# EAGLE design Sensor Decoderv0.6 (EAGLE 8.4.3)
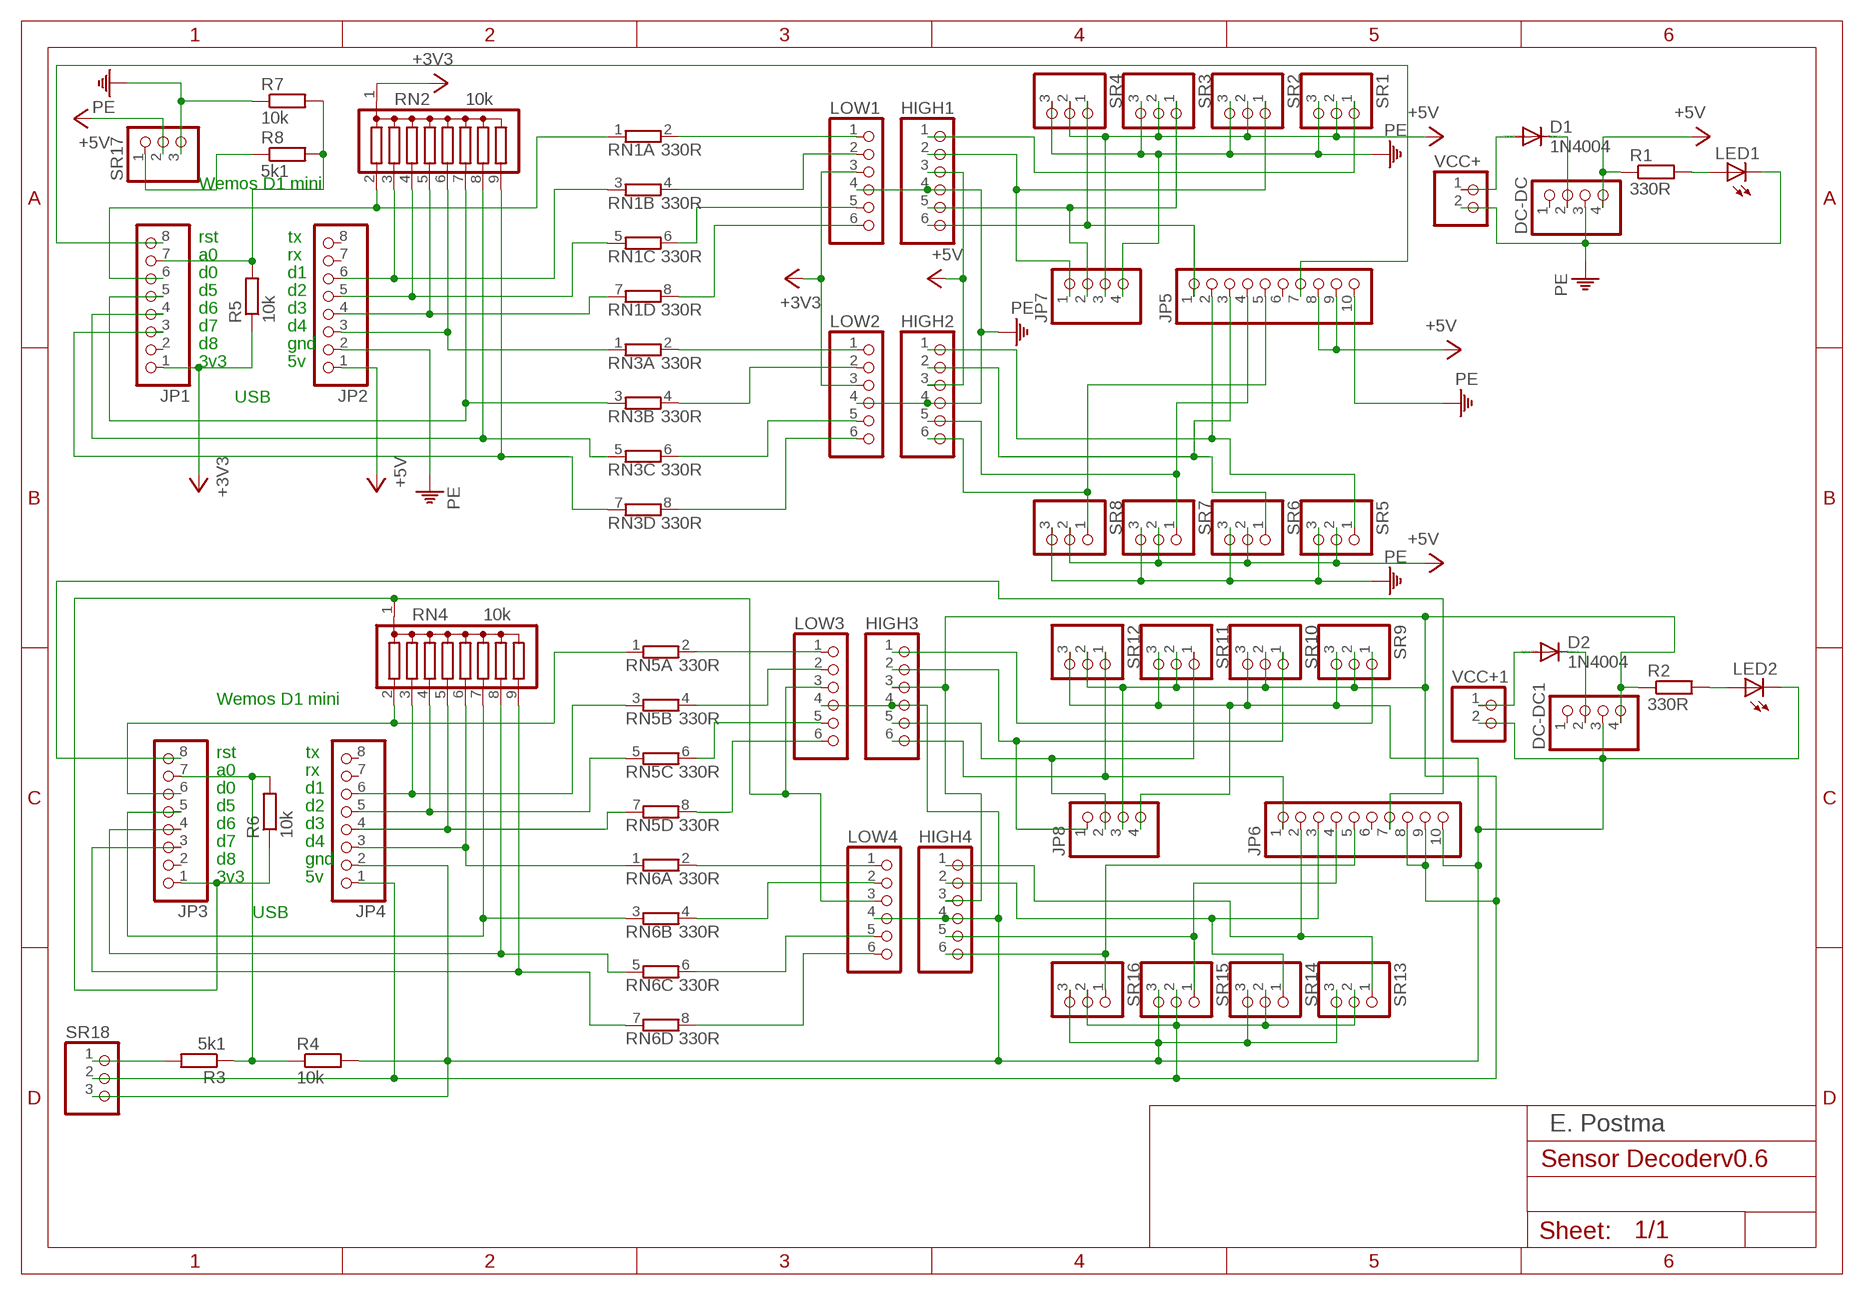
[diagram p0: schematic, sheet 1]

## Parts
D1  1N4004  [DO41-10]
D2  1N4004  [DO41-10]
DC-DC  PINHD-1X4  [1X04]
DC-DC1  PINHD-1X4  [1X04]
HIGH1  PINHD-1X6  [1X06]
HIGH2  PINHD-1X6  [1X06]
HIGH3  PINHD-1X6  [1X06]
HIGH4  PINHD-1X6  [1X06]
JP1  PINHD-1X8  [1X08]
JP2  PINHD-1X8  [1X08]
JP3  PINHD-1X8  [1X08]
JP4  PINHD-1X8  [1X08]
JP5  PINHD-1X10  [1X10]
JP6  PINHD-1X10  [1X10]
JP7  PINHD-1X4  [1X04]
JP8  PINHD-1X4  [1X04]
LED1  LED3MM  [LED3MM]
LED2  LED3MM  [LED3MM]
LOW1  PINHD-1X6  [1X06]
LOW2  PINHD-1X6  [1X06]
LOW3  PINHD-1X6  [1X06]
LOW4  PINHD-1X6  [1X06]
R1  330R  R-EU_0207/7  [0207/7]
R2  330R  R-EU_0207/7  [0207/7]
R3  5k1  R-EU_0207/7  [0207/7]
R4  10k  R-EU_0207/7  [0207/7]
R5  10k  R-EU_0207/7  [0207/7]
R6  10k  R-EU_0207/7  [0207/7]
R7  10k  R-EU_0207/7  [0207/7]
R8  5k1  R-EU_0207/7  [0207/7]
RN1  330R  E4R  [SIL8]
RN2  10k  G08R  [SIL9]
RN3  330R  E4R  [SIL8]
RN4  10k  G08R  [SIL9]
RN5  330R  E4R  [SIL8]
RN6  330R  E4R  [SIL8]
SR1  PINHD-1X3  [1X03]
SR2  PINHD-1X3  [1X03]
SR3  PINHD-1X3  [1X03]
SR4  PINHD-1X3  [1X03]
SR5  PINHD-1X3  [1X03]
SR6  PINHD-1X3  [1X03]
SR7  PINHD-1X3  [1X03]
SR8  PINHD-1X3  [1X03]
SR9  PINHD-1X3  [1X03]
SR10  PINHD-1X3  [1X03]
SR11  PINHD-1X3  [1X03]
SR12  PINHD-1X3  [1X03]
SR13  PINHD-1X3  [1X03]
SR14  PINHD-1X3  [1X03]
SR15  PINHD-1X3  [1X03]
SR16  PINHD-1X3  [1X03]
SR17  PINHD-1X3  [1X03]
SR18  PINHD-1X3  [1X03]
VCC+  PINHD-1X2  [1X02]
VCC+1  PINHD-1X2  [1X02]

## Nets
+3V3 [3.3V]: JP1.1 LOW1.3 LOW2.3 R5.1 RN2.1
+5V [5V]: DC-DC.4 HIGH1.3 HIGH2.3 JP2.1 JP5.8 JP5.9 JP7.3 R1.1 SR1.2 SR2.2 SR3.2 SR4.2 SR5.2 SR6.2 SR7.2 SR8.2 SR17.2
N$1: HIGH2.6 JP5.5 SR8.1
N$2: JP1.6 RN1.1 RN2.2
N$3: JP1.4 RN2.8 RN3.5
N$4 [5V]: D1.C DC-DC.2
N$5: JP1.5 RN2.7 RN3.3
N$6: LED1.A R1.2
N$7: JP2.5 RN1.5 RN2.4
N$8: HIGH2.5 JP5.4 SR7.1
N$9: JP2.3 RN2.6 RN3.1
N$10: JP2.6 RN1.3 RN2.3
N$11: JP1.3 RN2.9 RN3.7
N$12: LOW1.1 RN1.2
N$13: JP2.4 RN1.7 RN2.5
N$14: HIGH1.5 JP7.2 SR3.1
N$15: HIGH1.1 SR1.1
N$16: HIGH1.6 JP5.1 SR4.1
N$17: HIGH1.2 JP7.1 SR2.1
N$18: HIGH2.2 JP5.3 SR6.1
N$19: HIGH2.1 JP5.2 SR5.1
N$20: JP3.6 RN4.2 RN5.1
N$21: LED2.A R2.2
N$22: JP4.6 RN4.3 RN5.3
N$23: JP4.5 RN4.4 RN5.5
N$24: JP4.4 RN4.5 RN5.7
N$25 [5V]: D2.A VCC+1.1
N$26 [5V]: D2.C DC-DC1.2
N$27: JP4.3 RN4.6 RN6.1
N$28: JP3.5 RN4.7 RN6.3
N$29: JP3.4 RN4.8 RN6.5
N$30: JP3.3 RN4.9 RN6.7
N$31: LOW3.1 RN5.2
N$32: LOW3.2 RN5.4
N$33: LOW3.5 RN5.6
N$34: LOW3.6 RN5.8
N$35: LOW4.1 RN6.2
N$36: LOW4.2 RN6.4
N$37: LOW4.5 RN6.6
N$38: LOW4.6 RN6.8
N$39: HIGH4.6 JP6.5 SR16.1
N$40: HIGH4.5 JP6.4 SR15.1
N$41 [Gnd]: DC-DC1.3 HIGH3.4 HIGH4.4 JP4.2 JP6.10 JP8.4 LED2.K(C) LOW3.4 LOW4.4 R4.2 SR9.3 SR10.3 SR11.3 SR12.3 SR13.3 SR14.3 SR15.3 SR16.3 SR18.3 VCC+1.2
N$42 [Gnd]: JP3.8 JP6.7
N$43: JP1.8 JP5.7
N$44: LOW1.2 RN1.4
N$45: LOW1.5 RN1.6
N$46: LOW1.6 RN1.8
N$47 [5V]: D1.A VCC+.1
N$48: LOW2.1 RN3.2
N$49: LOW2.2 RN3.4
N$50: LOW2.5 RN3.6
N$51: LOW2.6 RN3.8
N$52 [5V]: DC-DC1.4 HIGH3.3 HIGH4.3 JP4.1 JP6.8 JP6.9 JP8.3 R2.1 SR9.2 SR10.2 SR11.2 SR12.2 SR13.2 SR14.2 SR15.2 SR16.2 SR18.2
N$53: HIGH3.1 SR9.1
N$54 [3.3V]: JP3.1 LOW3.3 LOW4.3 R6.1 RN4.1
N$58: JP1.7 R5.2 R7.2 R8.2
N$59: JP3.7 R3.1 R4.1 R6.2
N$60: R3.2 SR18.1
N$61: HIGH3.2 JP8.1 SR10.1
N$62: R8.1 SR17.1
N$63: HIGH3.5 JP8.2 SR11.1
N$64: HIGH3.6 JP6.1 SR12.1
N$65: HIGH4.2 JP6.3 SR14.1
N$66: HIGH4.1 JP6.2 SR13.1
PE [Gnd]: DC-DC.3 HIGH1.4 HIGH2.4 JP2.2 JP5.10 JP7.4 LED1.K(C) LOW1.4 LOW2.4 R7.1 SR1.3 SR2.3 SR3.3 SR4.3 SR5.3 SR6.3 SR7.3 SR8.3 SR17.3 VCC+.2
Unconnected: DC-DC1.1 DC-DC.1 JP1.2 JP2.7 JP2.8 JP3.2 JP4.7 JP4.8 JP5.6 JP6.6

## Notes on the sheet
- Wemos D1 mini
- rst | tx
- a0 | rx
- d0 | d1
- d5 | d2
- d6 | d3
- d7 | d4
- d8 | gnd
- 3v3 | 5v
- USB
- Wemos D1 mini
- rst | tx
- a0 | rx
- d0 | d1
- d5 | d2
- d6 | d3
- d7 | d4
- d8 | gnd
- 3v3 | 5v
- USB
- E. Postma

## Library data of the parts
D1 D2 = diode:1N4004: DIODE general purpose rectifier, 1 A
DC-DC DC-DC1 JP7 JP8 = pinhead:PINHD-1X4: PIN HEADER
HIGH1-HIGH4 LOW1-LOW4 = pinhead:PINHD-1X6: PIN HEADER
JP1-JP4 = pinhead:PINHD-1X8: PIN HEADER
JP5 JP6 = pinhead:PINHD-1X10: PIN HEADER
LED1 LED2 = led:LED: LED OSRAM: - CHIPLED LG R971, LG N971, LY N971, LG Q971, LY Q971, LO R971, LY R971 LH N974, LH R974 LS Q976, LO Q976, LY Q976 LO Q996 - Hyper CHIPLED LW Q18S LB Q993, LB Q99A, LB R99A - SideLED LS A670, LO A670, LY A670, LG A670, LP A670 LB A673, LV A673, LT A673, LW A673 LH A674 LY A675 LS A676, LA A676, LO A676, LY A676, LW A676 LS A679, LY A679, LG A679 - Hyper Micro SIDELED® LS Y876, LA Y876, LO Y876, LY Y876 LT Y87S - SmartLED LW L88C, LW L88S LB L89C, LB L89S, LG L890 LS L89K, LO L89K, LY L89K LS L896, LA L896, LO L896, LY L896 - TOPLED LS T670, LO T670, LY T670, LG T670, LP T670 LSG T670, LSP T670, LSY T670, LOP T670, LYG T670 LG T671, LOG T671, LSG T671 LB T673, LV T673, LT T673, LW T673 LH T674 LS T676, LA T676, LO T676, LY T676, LB T676, LH T676, LSB T676, LW T676 LB T67C, LV T67C, LT T67C, LS T67K, LO T67K, LY T67K, LW E67C LS E67B, LA E67B, LO E67B, LY E67B, LB E67C, LV E67C, LT E67C LW T67C LS T679, LY T679, LG T679 LS T770, LO T770, LY T770, LG T770, LP T770 LB T773, LV T773, LT T773, LW T773 LH T774 LS E675, LA E675, LY E675, LS T675 LS T776, LA T776, LO T776, LY T776, LB T776 LHGB T686 LT T68C, LB T68C - Hyper Mini TOPLED® LB M676 - Mini TOPLED Santana® LG M470 LS M47K, LO M47K, LY M47K Source: http://www.osram.convergy.de LUXEON: - LUMILED® LXK2-PW12-R00, LXK2-PW12-S00, LXK2-PW14-U00, LXK2-PW14-V00 LXK2-PM12-R00, LXK2-PM12-S00, LXK2-PM14-U00 LXK2-PE12-Q00, LXK2-PE12-R00, LXK2-PE12-S00, LXK2-PE14-T00, LXK2-PE14-U00 LXK2-PB12-K00, LXK2-PB12-L00, LXK2-PB12-M00, LXK2-PB14-N00, LXK2-PB14-P00, LXK2-PB14-Q00 LXK2-PR12-L00, LXK2-PR12-M00, LXK2-PR14-Q00, LXK2-PR14-R00 LXK2-PD12-Q00, LXK2-PD12-R00, LXK2-PD12-S00 LXK2-PH12-R00, LXK2-PH12-S00 LXK2-PL12-P00, LXK2-PL12-Q00, LXK2-PL12-R00 Source: www.luxeon.com KINGBRIGHT: KA-3528ASYC Source: www.kingbright.com
R1-R8 = resistor:R-EU_: RESISTOR, European symbol
RN1 RN3 RN5 RN6 = resistor-sil:E4R: SIL RESISTOR; OC_FARNELL: unknown; OC_NEWARK: unknown
RN2 RN4 = resistor-sil:G08R: SIL RESISTOR; OC_FARNELL: unknown; OC_NEWARK: unknown
SR1-SR18 = pinhead:PINHD-1X3: PIN HEADER
VCC+ VCC+1 = pinhead:PINHD-1X2: PIN HEADER

## Net classes
0 default: width 0.508 mm, clearance 0.254 mm
1 5V: width 0.762 mm, clearance 0.254 mm
2 Gnd: width 0.762 mm, clearance 0.254 mm
3 extra: width 0.762 mm, clearance 0.254 mm
4 3.3V: width 0.508 mm, clearance 0.254 mm

## Board
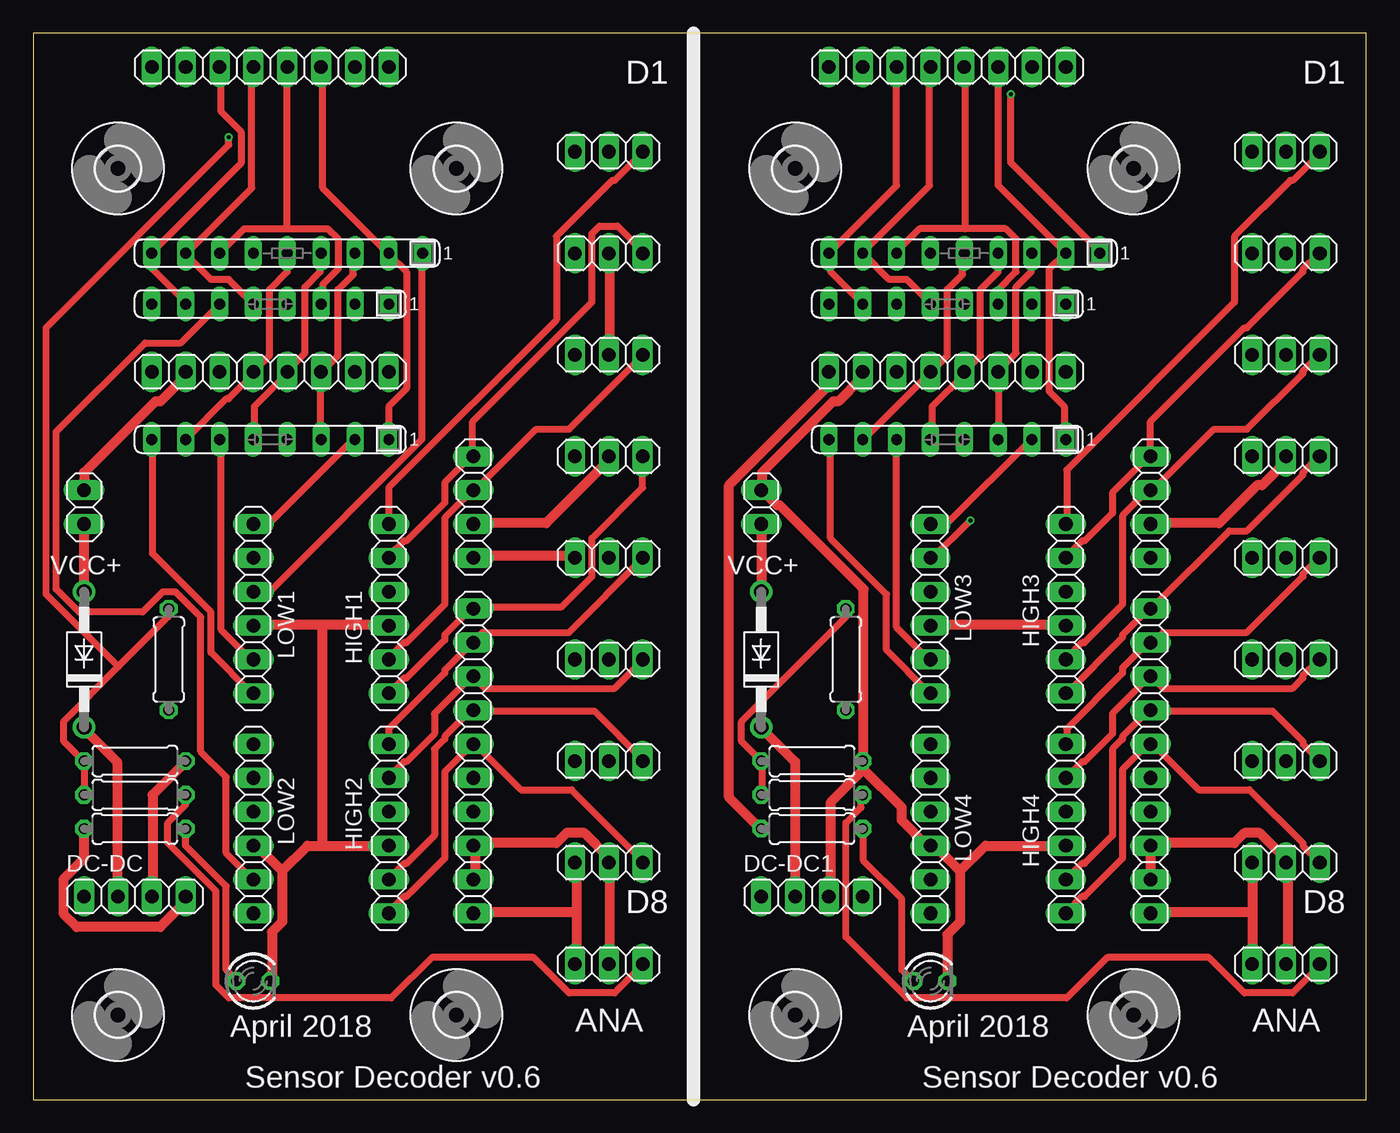
[diagram p1: board, top side]
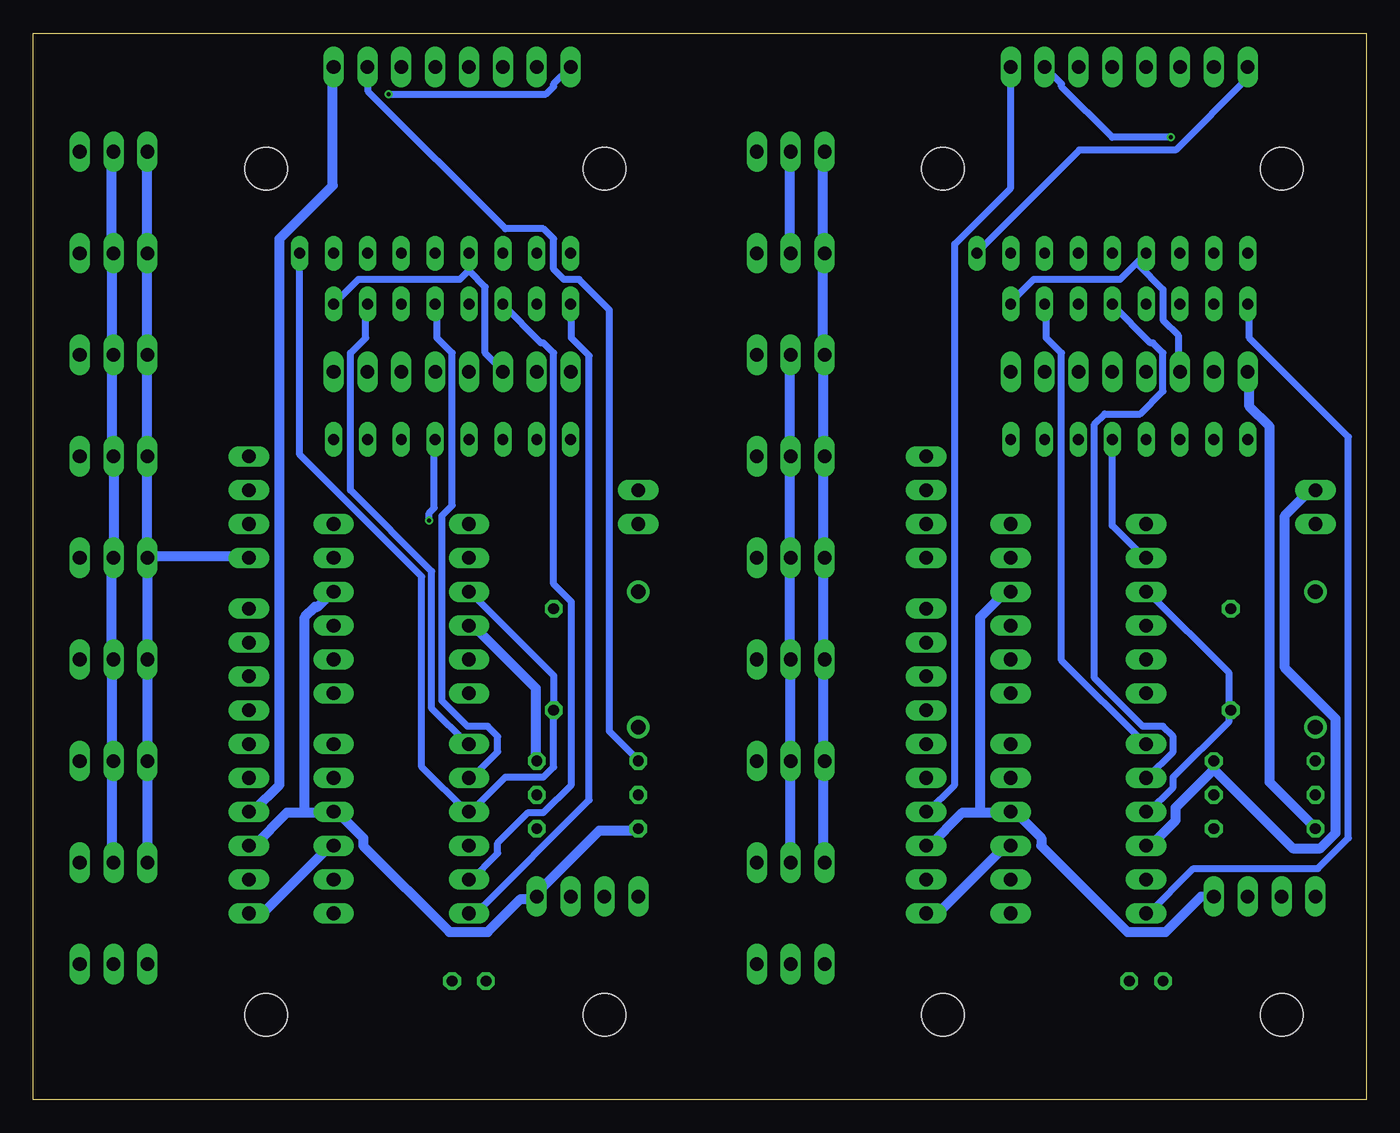
[diagram p2: board, bottom side, seen from below]

Size 100 x 80 mm. Coordinates in mm from the lower left corner, seen from the top.
Outline: 0,0 100,0 100,80 0,80 0,0
Copper layers (1*16): Top 0.035mm / dielectric 1.5mm / Bottom 0.035mm
Design rules "NOA Eagle Rule 2016-06-12": minimum track width 6mil, minimum drill 0.3mm, track to track 6mil, track to pad 6mil, pad to pad 6mil, via to via 6mil, smd to smd 0mil, copper to edge 0.4mm, drill to drill 10mil, minimum pad ring 10mil, minimum via ring 6mil, stop-mask expansion 2mil, vias tented up to drill 25mil, thermal gap 10mil
tKeepout: 1 lines
tRestrict: 1 lines
bRestrict: 1 lines

### Footprints (pad centres in the part's own frame; a part is rotated, then mirrored left to right if it is on the bottom)
DO41-10 = drill 1.118: A 5.08,0; C -5.08,0
1X04 = drill 1.016 long: 1 -3.81,0; 2 -1.27,0; 3 1.27,0; 4 3.81,0
1X06 = drill 1.016 long: 1 -6.35,0; 2 -3.81,0; 3 -1.27,0; 4 1.27,0; 5 3.81,0; 6 6.35,0
1X08 = drill 1.016 long: 1 -8.89,0; 2 -6.35,0; 3 -3.81,0; 4 -1.27,0; 5 1.27,0; 6 3.81,0; 7 6.35,0; 8 8.89,0
1X10 = drill 1.016 long: 1 -11.43,0; 2 -8.89,0; 3 -6.35,0; 4 -3.81,0; 5 -1.27,0; 6 1.27,0; 7 3.81,0; 8 6.35,0; 9 8.89,0; 10 11.43,0
LED3MM = drill 0.813 octagon: A -1.27,0; K 1.27,0
0207/7 = drill 0.813 octagon: 1 -3.81,0; 2 3.81,0
SIL8 = drill 0.813 long: 1 -8.89,0; 2 -6.35,0; 3 -3.81,0; 4 -1.27,0; 5 1.27,0; 6 3.81,0; 7 6.35,0; 8 8.89,0
SIL9 = drill 0.813 long: 1 -10.16,0; 2 -7.62,0; 3 -5.08,0; 4 -2.54,0; 5 0,0; 6 2.54,0; 7 5.08,0; 8 7.62,0; 9 10.16,0
1X03 = drill 1.016 long: 1 -2.54,0; 2 0,0; 3 2.54,0
3,2 = hole 3.2: 0,0
1X02 = drill 1.016 long: 1 -1.27,0; 2 1.27,0

### Placement (x,y rotation side)
D1  3.81,33.02 90 top
D2  54.61,33.02 90 top
DC-DC  7.62,15.24 0 top
DC-DC1  58.42,15.24 0 top
HIGH1  26.67,36.83 270 top
HIGH2  26.67,20.32 270 top
HIGH3  77.47,36.83 270 top
HIGH4  77.47,20.32 270 top
JP1  17.78,77.47 0 top
JP2  17.78,54.61 0 top
JP3  68.58,77.47 0 top
JP4  68.58,54.61 0 top
JP5  33.02,25.4 270 top
JP6  83.82,25.4 270 top
JP7  33.02,44.45 270 top
JP8  83.82,44.45 270 top
LED1  16.51,8.89 0 top
LED2  67.31,8.89 0 top
LOW1  16.51,36.83 270 top
LOW2  16.51,20.32 270 top
LOW3  67.31,36.83 270 top
LOW4  67.31,20.32 270 top
R1  7.62,20.32 0 top
R2  58.42,20.32 0 top
R3  58.42,22.86 0 top
R4  58.42,25.4 0 top
R5  10.16,33.02 90 top
R6  60.96,33.02 90 top
R7  7.62,25.4 180 top
R8  7.62,22.86 180 top
RN1  17.78,49.53 180 top
RN2  19.05,63.5 180 top
RN3  17.78,59.69 180 top
RN4  69.85,63.5 180 top
RN5  68.58,49.53 180 top
RN6  68.58,59.69 180 top
SR1  43.18,71.12 180 top
SR2  43.18,63.5 180 top
SR3  43.18,55.88 180 top
SR4  43.18,48.26 180 top
SR5  43.18,40.64 180 top
SR6  43.18,33.02 180 top
SR7  43.18,25.4 180 top
SR8  43.18,17.78 180 top
SR9  93.98,71.12 180 top
SR10  93.98,63.5 180 top
SR11  93.98,55.88 180 top
SR12  93.98,48.26 180 top
SR13  93.98,40.64 180 top
SR14  93.98,33.02 180 top
SR15  93.98,25.4 180 top
SR16  93.98,17.78 180 top
SR17  43.18,10.16 180 top
SR18  93.98,10.16 180 top
U$1  [3,2]  6.35,69.85 0 top
U$2  [3,2]  31.75,69.85 0 top
U$3  [3,2]  6.35,6.35 0 top
U$4  [3,2]  31.75,6.35 0 top
U$5  [3,2]  57.15,6.35 0 top
U$6  [3,2]  82.55,6.35 0 top
U$7  [3,2]  57.15,69.85 0 top
U$8  [3,2]  82.55,69.85 0 top
VCC+  3.81,44.45 90 top
VCC+1  54.61,44.45 90 top

### Tracks (layer width: path | path; a pad name or v marks a point on that pad's centre or on a via)
+3V3
  Top 0.508: LOW1.3 17.72,38.1 29.15,49.53 29.15,63.44 RN2.1
  Bottom 0.508: LOW2.3 16.38,21.53 14.48,23.43 14.48,24.19 10.29,28.38 10.29,29.15 R5.1 10.29,29.34 10.29,32 16.38,38.1 LOW1.3 | RN2.1 29.15,63.63 21.53,71.25 14.29,71.25 8.95,76.58 8.95,77.34 JP1.1
+5V
  Top 0.762: R1.1 3.81,18.1 2.29,16.57 2.29,13.91 3.24,12.95 9.53,12.95 11.43,14.86 DC-DC.4 | JP5.9 33.15,16.57 33.15,19.05 JP5.8 33.34,19.24 39.24,19.24 40.01,20 41.34,20 43.24,18.1 SR8.2 43.24,17.72 43.24,10.29 SR17.2 | SR3.2 43.24,56.01 43.24,63.44 SR2.2 | JP7.3 33.15,43.24 38.48,43.24 43.05,47.82 43.05,48.2 SR4.2
  Bottom 0.762: JP2.1 8.76,54.48 8.76,52.01 7.24,50.48 7.24,23.81 3.81,20.38 R1.1 | 28.96,21.53 30.29,21.53 32.77,19.05 JP5.8 | 28.96,21.53 26.67,21.53 HIGH2.3 26.48,21.72 24.38,19.62 24.38,19.05 17.91,12.57 15.05,12.57 12.38,15.24 DC-DC.4 | HIGH1.3 27.05,38.1 28.96,36.2 28.96,21.53 | SR1.2 43.24,71.06 43.24,63.63 SR2.2 | SR8.2 43.24,17.91 43.24,25.15 SR7.2 43.24,25.53 43.24,32.96 SR6.2 43.24,33.34 43.24,40.58 SR5.2 43.24,40.96 43.24,48.2 SR4.2 43.24,48.58 43.24,55.82 SR3.2
N$1
  Top 0.508: HIGH2.6 26.67,14.1 27.81,15.24 28,15.24 30.86,18.1 30.86,24.57 32.96,26.67 JP5.5 33.15,26.67 36.58,23.24 40.39,23.24 45.72,17.91 SR8.1
N$2
  Top 0.508: RN1.1 26.67,52.01 28,53.34 28,62.1 26.67,63.44 RN2.2 26.48,63.63 21.72,68.39 21.72,77.34 JP1.6
N$3
  Top 0.508: RN3.5 14.67,61.53 13.34,61.53 11.43,63.44 RN2.8 11.62,63.63 16.38,68.39 16.38,77.34 JP1.4
N$4
  Top 0.762: DC-DC.2 6.29,15.24 6.29,25.34 3.81,27.81 D1.C
N$5
  Top 0.508: 19.05,65.34 15.81,65.34 RN2.7 | 19.05,65.34 22.1,65.34 22.86,64.58 22.86,62.29 21.72,61.15 21.72,59.82 RN3.3 | 19.05,65.34 JP1.5
N$6
  Top 0.508: R1.2 11.43,19.05 14.48,16 14.48,9.72 15.24,8.95 LED1.A
N$7
  Top 0.508: RN1.5 16.57,49.53 16.57,52.01 19.05,54.48 JP2.5 19.05,54.67 20.38,56.01 20.38,60.96 21.53,62.1 21.53,63.44 RN2.4
N$8
  Top 0.508: HIGH2.5 26.67,16.57 27.81,17.72 28,17.72 30.1,19.81 30.1,26.29 30.86,27.05 30.86,27.24 32.96,29.34 JP5.4 33.15,29.15 42.1,29.15 45.72,25.53 SR7.1
N$9
  Bottom 0.508: RN3.1 26.67,59.82 24.96,61.53 18.48,61.53 RN2.6 17.14,62.67 15.24,60.77 15.24,58.48 14.1,57.34 14.1,54.67 JP2.3
N$10
  Top 0.508: RN1.3 21.53,49.53 21.53,54.48 JP2.6 21.72,54.67 22.86,55.82 22.86,60.77 24,61.91 24,63.44 RN2.3
N$11
  Top 0.508: RN3.7 11.43,59.82 8.95,62.29 8.95,63.44 RN2.9 8.95,63.63 15.62,70.29 15.62,72.58 14.1,74.11 14.1,77.34 JP1.3
N$12
  Top 0.508: RN1.2 24,49.53 17.72,43.24 16.57,43.24 LOW1.1
N$13
  Top 0.508: RN1.7 14.48,52.58 14.67,52.58 16.57,54.48 JP2.4 17.72,55.82 17.72,60.77 19.05,62.1 RN2.5
N$14
  Top 0.508: HIGH1.5 26.67,33.15 27.81,34.29 28,34.29 30.86,37.15 30.86,43.62 32.96,45.72 JP7.2 33.15,45.72 37.72,50.29 40.2,50.29 45.72,55.82 SR3.1
N$15
  Top 0.508: HIGH1.1 26.67,45.91 39.24,58.48 39.24,64.77 43.43,68.96 43.62,68.96 45.72,71.06 SR1.1
N$16
  Top 0.508: HIGH1.6 27.81,31.62 28,31.62 30.86,34.48 30.86,34.86 32.96,36.96 JP5.1 33.15,36.96 39.62,36.96 41.91,39.24 41.91,42.1 45.72,45.91 SR4.1
N$17
  Top 0.508: HIGH1.2 26.67,40.77 27.81,41.91 28,41.91 30.86,44.77 30.86,46.29 32.96,48.39 JP7.1 32.96,48.58 32.96,50.86 41.91,59.82 41.91,64.96 42.48,65.53 43.81,65.53 45.72,63.63 SR2.1
N$18
  Top 0.508: HIGH2.2 26.67,24.19 27.81,25.34 28,25.34 30.1,27.43 30.1,28.96 32.96,31.81 JP5.3 33.91,30.86 43.62,30.86 45.72,32.96 SR6.1
N$19
  Top 0.508: HIGH2.1 26.67,27.81 30.86,32 30.86,32.19 32.96,34.29 JP5.2 33.15,34.48 33.72,35.05 40.2,35.05 45.72,40.58 SR5.1
N$20
  Top 0.508: RN5.1 77.34,49.53 77.34,52.01 76.2,53.15 76.2,62.29 77.34,63.44 RN4.2 72.39,68.58 JP3.6
N$21
  Top 0.508: R2.2 62.29,20.19 62.29,17.91 65.15,15.05 65.15,9.72 65.91,8.95 LED2.A
N$22
  Top 0.508: RN5.3 JP4.6 72.39,54.67 73.72,56.01 73.72,60.96 74.87,62.1 74.87,63.44 RN4.3
N$23
  Top 0.508: RN5.5 67.44,49.53 67.44,52.01 69.91,54.48 JP4.5 71.06,55.82 71.06,60.77 72.39,62.1 RN4.4
N$24
  Top 0.508: RN5.7 62.29,49.53 67.25,54.48 JP4.4 67.44,54.67 68.58,55.82 68.58,60.77 69.72,61.91 69.72,63.44 RN4.5
N$25
  Top 0.762: VCC+1.1 54.67,43.05 54.67,38.1 D2.A
N$26
  Top 0.762: DC-DC1.2 57.15,25.34 54.67,27.81 D2.C
N$27
  Bottom 0.508: 67.25,62.1 67.25,63.44 RN4.6 | 67.25,62.1 66.1,60.96 66.1,56.01 64.77,54.67 JP4.3 | RN6.1 75.63,61.53 68.01,61.53 67.44,62.1 67.25,62.1
N$28
  Top 0.508: 69.91,65.34 72.96,65.34 73.72,64.58 73.72,62.1 72.39,60.77 RN6.3 | 69.91,65.34 66.48,65.34 64.77,63.63 RN4.7 | 69.91,65.34 69.91,77.34 JP3.5
N$29
  Top 0.508: RN6.5 67.25,59.82 65.53,61.53 64.2,61.53 RN4.8 62.29,63.63 67.25,68.58 67.25,77.34 JP3.4
N$30
  Top 0.508: RN6.7 59.82,62.1 59.82,63.44 RN4.9 64.77,68.58 JP3.3
N$31
  Top 0.508: RN5.2 74.87,49.53 68.58,43.24 67.44,43.24 LOW3.1
N$32  (via drill 0.3)
  Top 0.508: v70.29,43.43 67.44,40.58 LOW3.2
  Bottom 0.508: v70.29,43.43 70.29,44.01 69.91,44.39 69.91,49.53 RN5.4
N$33
  Top 0.508: RN5.6 64.77,35.43 67.25,32.96 LOW3.5
N$34
  Top 0.508: RN5.8 59.82,49.53 59.82,42.1 64.01,37.91 64.01,33.72 67.25,30.48 LOW3.6
N$35
  Bottom 0.508: RN6.2 75.06,59.63 75.06,57.15 76.2,56.01 76.2,45.72 70.1,39.62 70.1,29.34 67.44,26.67 LOW4.1
N$36
  Bottom 0.508: RN6.4 69.72,59.63 69.72,57.15 68.58,56.01 68.58,44.58 69.34,43.81 69.34,29.91 67.44,28 65.91,28 65.15,27.24 65.15,26.1 67.25,24 LOW4.2
N$37
  Bottom 0.508: RN6.6 64.77,59.63 61.91,56.77 61.72,56.77 60.96,56.01 60.96,38.67 59.63,37.34 59.63,23.62 61.72,21.53 62.87,21.53 65.15,19.24 65.15,18.48 67.25,16.38 LOW4.5
N$38
  Bottom 0.508: RN6.8 59.63,59.63 59.63,57.15 58.29,55.82 58.29,22.48 66.67,14.1 67.25,14.1 LOW4.6
N$39
  Top 0.508: HIGH4.6 77.53,14.1 78.68,15.24 78.87,15.24 81.72,18.1 81.72,24.77 83.63,26.67 JP6.5 84.01,26.67 87.44,23.24 91.25,23.24 95.25,19.24 95.25,19.05 SR16.1
N$40
  Top 0.508: HIGH4.5 78.68,17.72 78.87,17.72 80.96,19.81 80.96,26.29 81.72,27.05 81.72,27.24 83.82,29.34 JP6.4 84.01,29.15 92.96,29.15 95.25,26.86 95.25,26.67 SR15.1
N$41
  Top 0.762: SR16.3 91.44,14.1 | 91.44,14.1 SR18.3 | JP4.2 62.1,54.48 62.1,54.1 60.39,52.39 60.01,52.39 54.67,47.05 54.67,45.72 VCC+1.2 54.86,45.53 55.82,44.58 56.01,44.58 62.29,38.29 62.29,25.72 R4.2 62.29,25.34 62.29,24.77 | LOW3.4 67.44,35.62 77.34,35.62 HIGH3.4 | LED2.K 68.58,12.38 69.53,13.34 69.53,17.14 | 69.53,17.14 67.63,19.05 LOW4.4 67.06,19.05 65.15,20.95 65.15,21.91 62.29,24.77 | 62.29,24.77 59.82,22.29 59.82,15.24 DC-DC1.3 | HIGH4.4 71.44,19.05 69.53,17.14 | 91.44,14.1 83.82,14.1 JP6.10
  Bottom 0.762: SR16.3 SR15.3 SR14.3 SR13.3 | JP8.4 83.82,40.77 91.44,40.77 SR13.3 | SR13.3 SR12.3 SR11.3 SR10.3 SR9.3 | HIGH4.4 77.72,19.05 82.68,14.1 83.82,14.1 JP6.10 | LOW3.4 67.25,35.43 66.86,35.43 62.29,30.86 62.29,25.53 R4.2
N$42
  Bottom 0.762: JP3.8 77.53,77.34 77.53,68.58 81.53,64.58 81.53,23.62 83.44,21.72 83.82,21.72 JP6.7
N$43
  Bottom 0.508: JP1.8 26.67,68.39 30.86,64.2 30.86,23.62 32.96,21.53 JP5.7
N$44
  Bottom 0.508: RN1.4 19.05,43.05 16.57,40.58 LOW1.2
N$45
  Top 0.508: RN1.6 14.1,49.53 14.1,35.24 16.38,32.96 LOW1.5
N$46
  Top 0.508: RN1.8 8.95,49.53 8.95,40.96 13.34,36.58 13.34,33.53 16.38,30.48 LOW1.6
N$47
  Top 0.762: D1.A VCC+.1
N$48
  Bottom 0.508: RN3.2 24,59.63 24,57.15 22.86,56.01 22.86,32.96 16.57,26.67 LOW2.1
N$49
  Bottom 0.508: RN3.4 19.05,59.63 16.19,56.77 16,56.77 15.24,56.01 15.24,53.15 16.95,51.44 19.62,51.44 20.38,50.67 20.38,31.62 16.76,28 15.24,28 14.48,27.24 14.48,26.1 16.38,24.19 LOW2.2
N$50
  Top 0.508: RN3.6 11.05,56.77 8.38,56.77 1.71,50.1 1.71,38.29 3.43,36.58 8.19,36.58 9.72,38.1 10.67,38.1 12.57,36.2 12.57,26.1 14.48,24.19 14.48,18.48 16.38,16.57 LOW2.5
N$51
  Bottom 0.508: RN3.8 8.76,59.63 8.76,57.15 1.33,49.72 1.33,19.62 3.62,17.34 12.95,17.34 16.38,13.91 LOW2.6
N$52
  Top 0.762: JP4.1 59.63,54.48 59.63,53.53 52.2,46.1 52.2,22.67 54.48,20.38 R2.1 | JP8.3 83.82,43.24 88.96,43.24 91.82,46.1 92.2,46.1 93.92,47.82 93.92,48.2 SR12.2 | JP6.9 JP6.8 84.01,19.24 90.11,19.24 90.87,20 92.01,20 93.92,18.1 SR16.2 94.11,17.72 94.11,10.29 SR18.2
  Bottom 0.762: R2.1 54.67,20.19 57.53,20.19 62.1,15.62 62.1,15.24 DC-DC1.4 62.48,15.05 63.44,15.05 65.91,12.57 68.77,12.57 75.25,19.05 75.25,19.62 77.15,21.53 HIGH4.3 77.53,21.53 79.63,21.53 | SR9.2 94.11,71.06 94.11,63.82 SR10.2 94.11,63.44 94.11,56.01 SR11.2 94.11,55.63 94.11,48.39 SR12.2 93.92,48.01 93.92,40.96 SR13.2 94.11,40.58 94.11,33.34 SR14.2 94.11,32.96 94.11,25.53 SR15.2 94.11,25.15 94.11,17.91 SR16.2 | 79.63,21.53 80.96,21.53 83.44,19.05 JP6.8 | 79.63,21.53 79.63,36.2 78.87,36.96 78.68,36.96 77.53,38.1 HIGH3.3
N$53
  Top 0.508: HIGH3.1 77.53,43.24 77.53,47.24 90.11,59.82 90.11,64.77 94.3,68.96 94.49,68.96 96.58,71.06 SR9.1
N$54  (via drill 0.3)
  Top 0.508: v73.34,75.44 73.34,70.29 80.01,63.63 RN4.1
  Bottom 0.508: LOW3.3 67.25,38.1 60.96,31.81 R6.1 60.96,24.96 61.72,24.19 64.58,24.19 67.25,21.53 LOW4.3 67.44,21.53 70.87,24.96 70.87,39.24 80.01,48.39 RN4.1 | JP3.1 60.96,76.2 60.96,76.01 61.53,75.44 v73.34,75.44
N$58  (via drill 0.3)
  Top 0.508: R8.2 R7.2 3.62,25.53 2.29,26.86 2.29,28.38 6.38,32.48 | 6.38,32.48 10.1,36.2 10.1,36.77 R5.2 | v14.67,72.2 14.67,71.63 0.95,57.91 0.95,37.91 6.38,32.48
  Bottom 0.508: JP1.7 22.86,76.2 22.86,76.01 19.05,72.2 v14.67,72.2
N$59
  Top 0.508: R3.1 54.67,22.86 54.67,25.34 R4.1 53.15,26.86 53.15,28.38 60.96,36.2 R6.2
  Bottom 0.508: JP3.7 74.87,77.34 74.87,75.63 64.58,65.34 61.72,65.34 60.96,64.58 60.96,62.29 60.2,61.53 59.05,61.53 56.77,59.24 56.77,27.62 54.67,25.53 R4.1
N$60
  Top 0.508: R3.2 62.1,22.86 62.1,21.91 60.96,20.77 60.96,12.19 65.53,7.62 77.53,7.62 80.58,10.67 88.2,10.67 90.87,8 94.49,8 96.58,10.1 SR18.1
N$61
  Top 0.508: HIGH3.2 77.53,40.77 78.68,41.91 78.87,41.91 80.96,44.01 80.96,45.53 83.82,48.39 JP8.1 83.82,50.86 90.87,57.91 91.06,57.91 95.25,62.1 95.25,62.29 96.39,63.44 SR10.1
N$62
  Top 0.508: R8.1 11.43,22.1 10.1,20.77 10.1,19.24 13.72,15.62 13.72,8.57 14.67,7.62 26.86,7.62 29.91,10.67 37.53,10.67 40.2,8 43.62,8 45.72,10.1 SR17.1
N$63
  Top 0.508: HIGH3.5 77.53,33.15 78.68,34.29 78.87,34.29 81.72,37.15 81.72,43.81 83.63,45.72 JP8.2 84.01,45.72 88.58,50.29 91.06,50.29 95.25,54.48 95.25,54.67 96.39,55.82 SR11.1
N$64
  Top 0.508: HIGH3.6 77.53,30.48 81.72,34.67 81.72,34.86 83.82,36.96 JP6.1 84.01,36.96 89.72,42.67 91.06,42.67 95.25,46.86 95.25,47.05 96.39,48.2 SR12.1
N$65
  Top 0.508: HIGH4.2 78.68,25.34 78.87,25.34 80.96,27.43 80.96,28.96 83.82,31.81 JP6.3 84.01,31.62 84.77,30.86 94.49,30.86 95.25,31.62 95.25,31.81 96.39,32.96 SR14.1
N$66
  Top 0.508: HIGH4.1 77.53,26.67 77.53,27.81 81.72,32 81.72,32.38 83.63,34.29 JP6.2 84.01,34.29 84.77,35.05 91.06,35.05 95.25,39.24 95.25,39.43 96.39,40.58 SR13.1
PE
  Top 0.762: 40.77,14.1 40.77,17.72 SR8.3 | 40.77,14.1 40.77,10.29 SR17.3 | JP7.4 33.15,40.77 40.58,40.77 SR5.3 | VCC+.2 3.81,47.05 9.14,52.39 9.53,52.39 11.43,54.29 JP2.2 | 21.72,35.62 26.67,35.62 HIGH1.4 | 21.72,35.62 16.57,35.62 LOW1.4 | 18.67,17.14 18.67,13.34 17.91,12.57 17.91,8.95 LED1.K | 18.67,17.14 16.76,19.05 LOW2.4 | DC-DC.3 8.95,15.24 8.95,22.86 11.43,25.34 R7.1 | 21.72,19.05 20.57,19.05 18.67,17.14 | 21.72,19.05 HIGH2.4 | 21.72,19.05 21.72,35.62 | 40.77,14.1 33.15,14.1 JP5.10
  Bottom 0.762: SR8.3 40.77,17.91 40.77,25.15 SR7.3 40.77,25.53 40.77,32.96 SR6.3 40.77,33.34 40.77,40.39 SR5.3 40.77,40.77 40.77,48.01 SR4.3 40.77,48.39 40.77,55.82 SR3.3 40.77,56.2 40.77,63.44 SR2.3 40.77,63.82 40.77,71.06 SR1.3 | 11.43,24.77 R7.1 | 11.43,24.77 14.29,21.91 14.29,20.95 16.19,19.05 LOW2.4 | HIGH2.4 27.05,19.05 32,14.1 32.96,14.1 JP5.10 | VCC+.2 4.19,45.72 6.1,43.81 6.1,32.38 2.29,28.57 2.29,20 3.43,18.86 5.52,18.86 11.43,24.77

### Text on the board
tNames: D1 | D1 | VCC+ | VCC+ | D8 | D8 | April 2018 | April 2018 | ANA | ANA | Sensor Decoder v0.6 | Sensor Decoder v0.6